# EAGLE board 7seg_interface_unit (EAGLE 9.5.2)
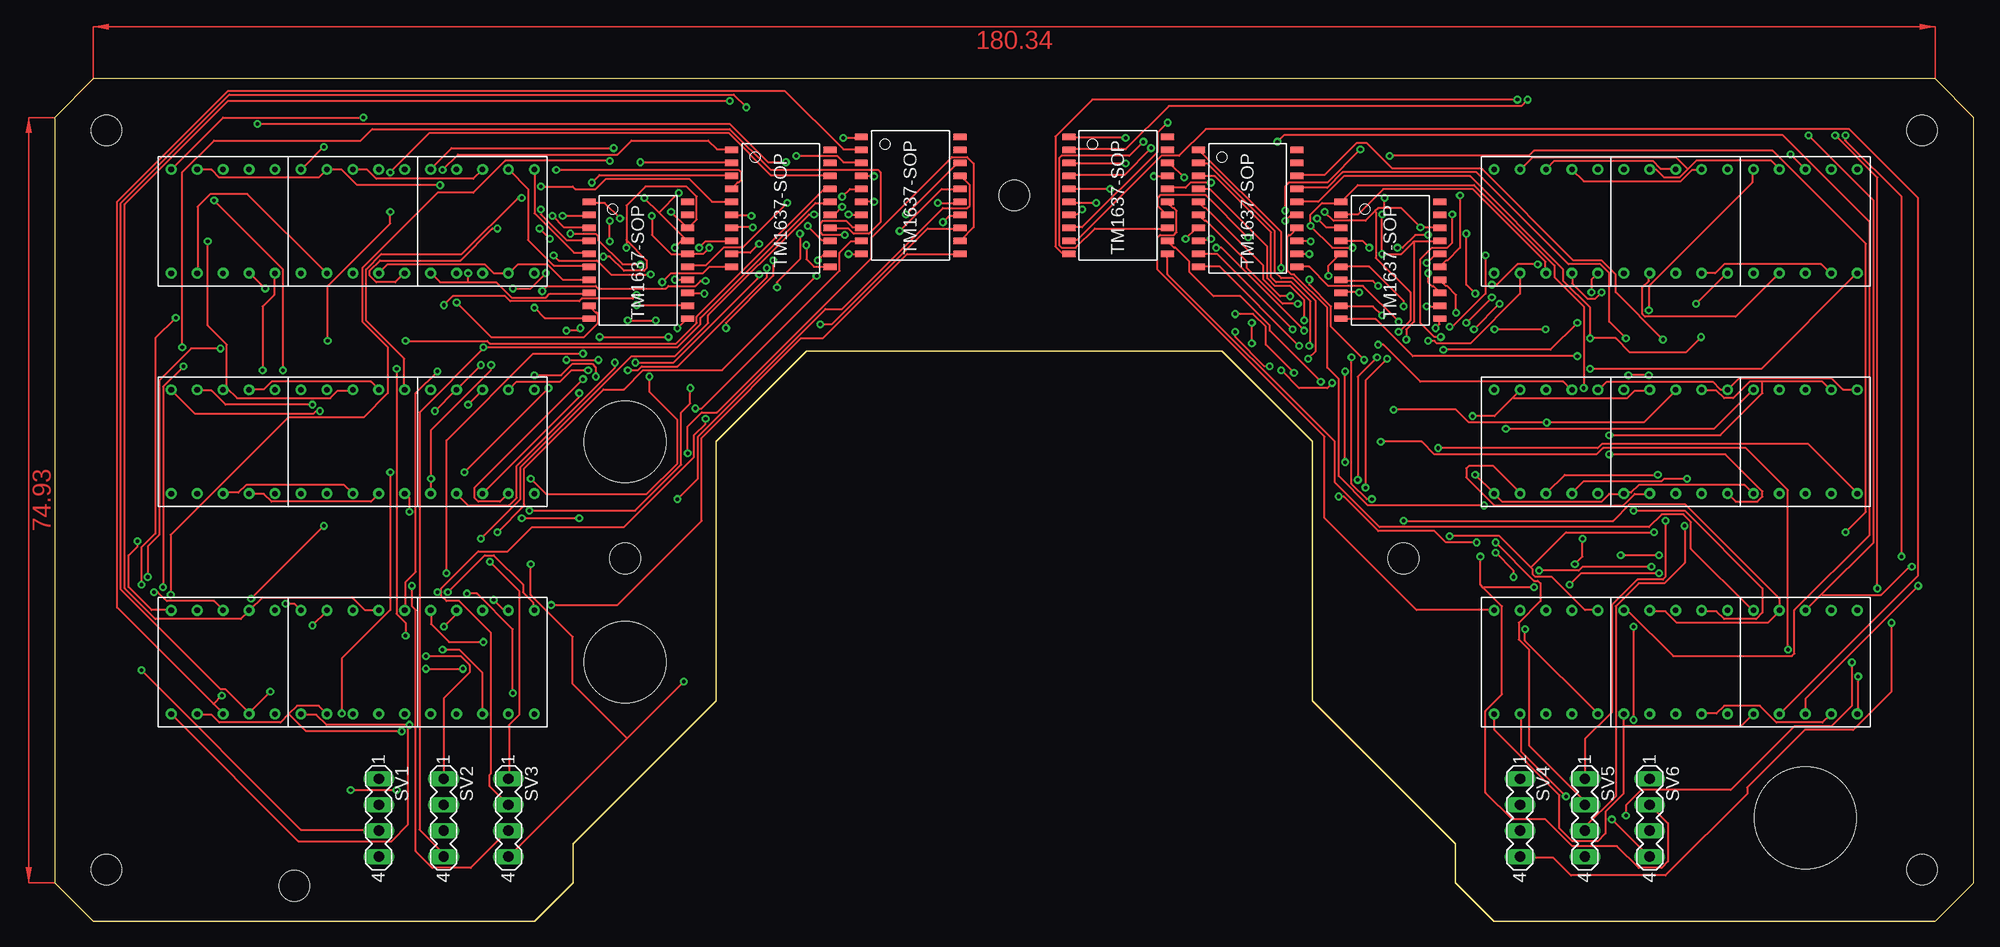
[diagram p1: board, top side]
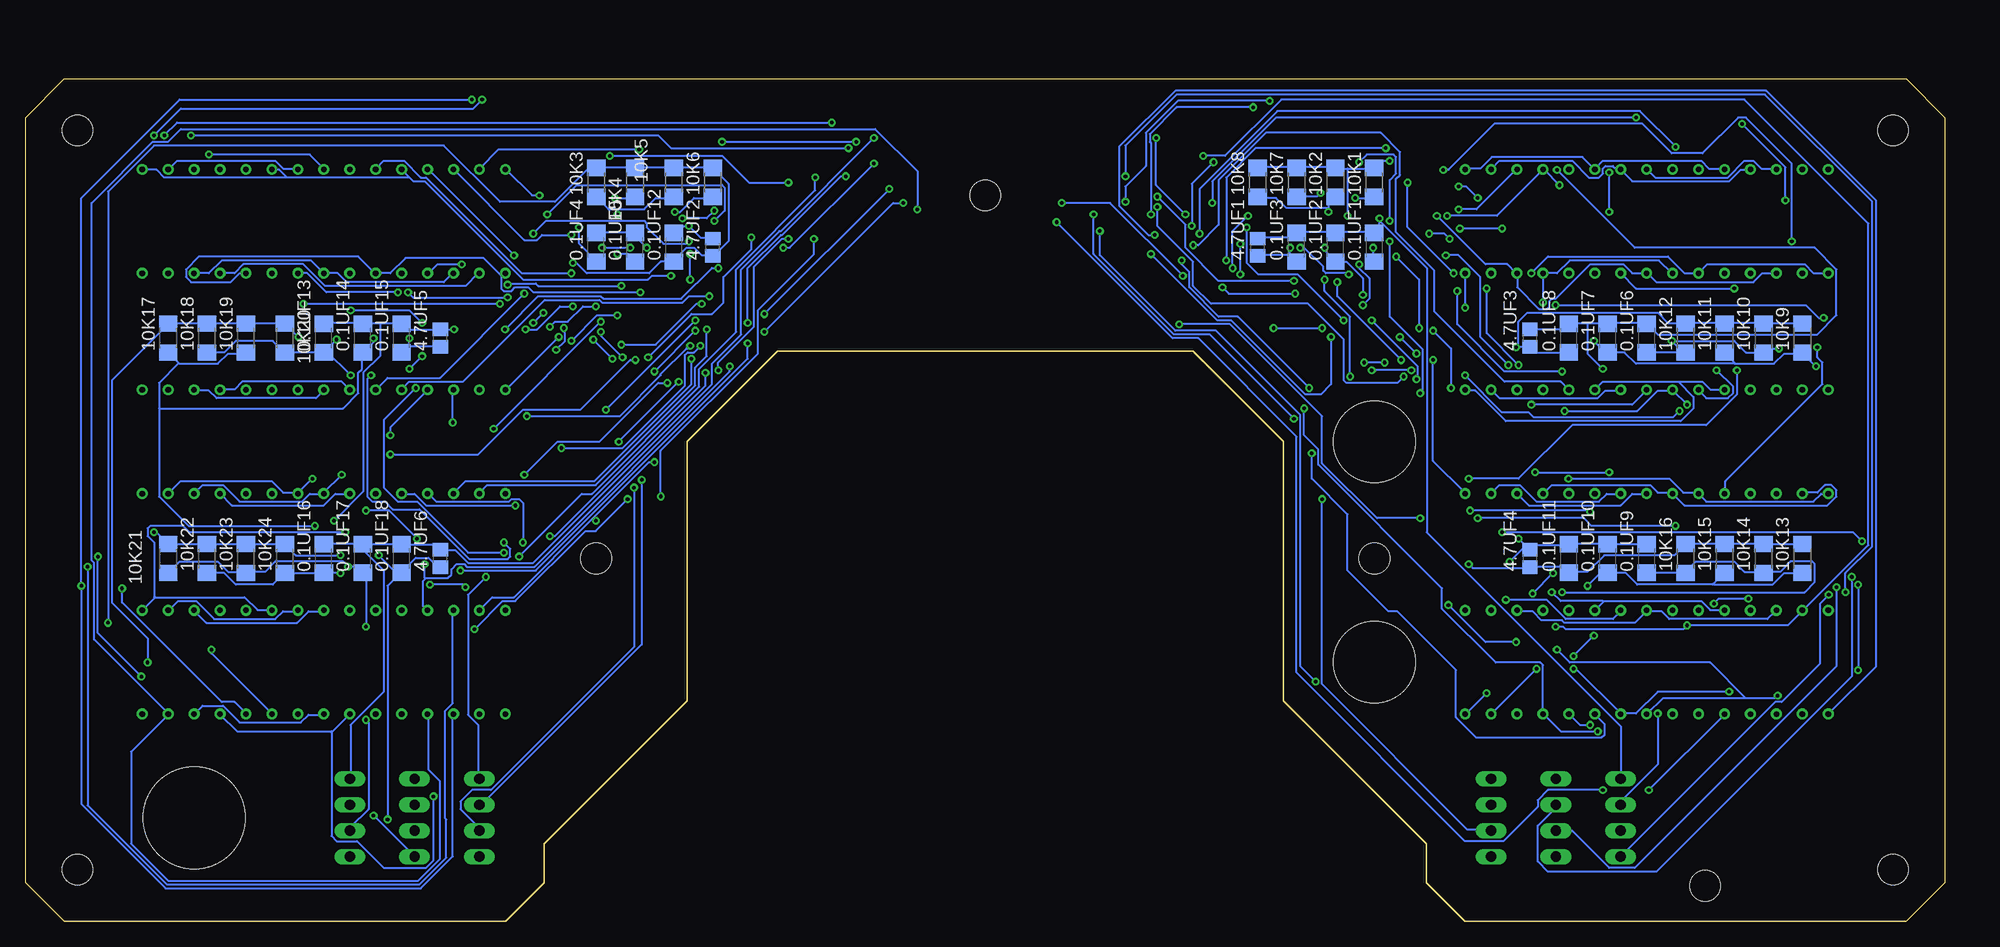
[diagram p2: board, bottom side, seen from below]

Size 187.96 x 82.55 mm. Coordinates in mm from the lower left corner, seen from the top.
Outline: 184.15,0 187.96,3.81 187.96,78.74 184.15,82.55 3.81,82.55 0,78.74 0,3.81 3.81,0 46.99,0 50.8,3.81 50.8,7.62 64.77,21.59 64.77,46.99 73.66,55.88 114.3,55.88 123.19,46.99 123.19,21.59 137.16,7.62 137.16,3.81 140.97,0 184.15,0
Copper layers (1*16): Top 0.035mm / dielectric 1.5mm / Bottom 0.035mm
Design rules "default": minimum track width 6mil, minimum drill 0.35mm, track to track 6mil, track to pad 6mil, pad to pad 6mil, via to via 6mil, smd to smd 6mil, copper to edge 40mil, drill to drill 6mil, minimum pad ring 10mil, minimum via ring 8mil, stop-mask expansion 4mil, vias tented up to drill 0mil, thermal gap 10mil
Net classes: 0 default: width 0.178 mm, clearance 0.127 mm
Holes 8 mm at 55.88,25.4 55.88,46.99
Holes 10 mm at 171.45,10.16
Holes 3 mm at 5.08,77.47 5.08,5.08 182.88,77.47 182.88,5.08 93.98,71.12 55.88,35.56 132.08,35.56 23.5,3.5

## Footprints (pad centres in the part's own frame; a part is rotated, then mirrored left to right if it is on the bottom)
C1206 = smd 1.6 x 1.8: 1 -1.4,0; 2 1.4,0
C2012 = smd 1.3 x 1.5: 1 -0.85,0; 2 0.85,0
R1206 = smd 1.6 x 1.803: 1 -1.422,0; 2 1.422,0
7SEG = drill 0.55: 1 1.27,1.27; 2 3.81,1.27; 3 6.35,1.27; 4 8.89,1.27; 5 11.43,1.27; 6 11.43,11.43; 7 8.89,11.43; 8 6.35,11.43; 9 3.81,11.43; 10 1.27,11.43
MA04-1 = drill 1.016 long: 1 -3.81,0; 2 -1.27,0; 3 1.27,0; 4 3.81,0
TM1637 = smd 1.27 x 0.635: PIN1 -4.82,5.715; PIN2 -4.82,4.445; PIN3 -4.82,3.175; PIN4 -4.82,1.905; PIN5 -4.82,0.635; PIN6 -4.82,-0.635; PIN7 -4.82,-1.905; PIN8 -4.82,-3.175; PIN9 -4.82,-4.445; PIN10 -4.82,-5.715; PIN11 4.83,-5.715; PIN12 4.83,-4.445; PIN13 4.83,-3.175; PIN14 4.83,-1.905; PIN15 4.83,-0.635; PIN16 4.83,0.635; PIN17 4.83,1.905; PIN18 4.83,3.175; PIN19 4.83,4.445; PIN20 4.83,5.715

## Placement (x,y rotation side)
0.1UF1  [C1206]  55.88,66.04 90 bottom
0.1UF2  [C1206]  59.69,66.04 90 bottom
0.1UF3  [C1206]  63.5,66.04 90 bottom
0.1UF4  [C1206]  132.08,66.04 90 bottom
0.1UF5  [C1206]  128.27,66.04 90 bottom
0.1UF6  [C1206]  29.21,57.15 90 bottom
0.1UF7  [C1206]  33.02,57.15 90 bottom
0.1UF8  [C1206]  36.83,57.15 90 bottom
0.1UF9  [C1206]  29.21,35.56 90 bottom
0.1UF10  [C1206]  33.02,35.56 90 bottom
0.1UF11  [C1206]  36.83,35.56 90 bottom
0.1UF12  [C1206]  124.46,66.04 90 bottom
0.1UF13  [C1206]  158.75,57.15 90 bottom
0.1UF14  [C1206]  154.94,57.15 90 bottom
0.1UF15  [C1206]  151.13,57.15 90 bottom
0.1UF16  [C1206]  158.75,35.56 90 bottom
0.1UF17  [C1206]  154.94,35.56 90 bottom
0.1UF18  [C1206]  151.13,35.56 90 bottom
4.7UF1  [C2012]  67.31,66.04 90 bottom
4.7UF2  [C2012]  120.65,66.04 90 bottom
4.7UF3  [C2012]  40.64,57.15 90 bottom
4.7UF4  [C2012]  40.64,35.56 90 bottom
4.7UF5  [C2012]  147.32,57.15 90 bottom
4.7UF6  [C2012]  147.32,35.56 90 bottom
10K1  [R1206]  55.88,72.39 90 bottom
10K2  [R1206]  59.69,72.39 90 bottom
10K3  [R1206]  132.08,72.39 90 bottom
10K4  [R1206]  128.27,72.39 90 bottom
10K5  [R1206]  124.46,72.39 90 bottom
10K6  [R1206]  120.65,72.39 90 bottom
10K7  [R1206]  63.5,72.39 90 bottom
10K8  [R1206]  67.31,72.39 90 bottom
10K9  [R1206]  13.97,57.15 90 bottom
10K10  [R1206]  17.78,57.15 90 bottom
10K11  [R1206]  21.59,57.15 90 bottom
10K12  [R1206]  25.4,57.15 90 bottom
10K13  [R1206]  13.97,35.56 90 bottom
10K14  [R1206]  17.78,35.56 90 bottom
10K15  [R1206]  21.59,35.56 90 bottom
10K16  [R1206]  25.4,35.56 90 bottom
10K17  [R1206]  173.99,57.15 90 bottom
10K18  [R1206]  170.18,57.15 90 bottom
10K19  [R1206]  166.37,57.15 90 bottom
10K20  [R1206]  162.56,57.15 90 bottom
10K21  [R1206]  173.99,35.56 90 bottom
10K22  [R1206]  170.18,35.56 90 bottom
10K23  [R1206]  166.37,35.56 90 bottom
10K24  [R1206]  162.56,35.56 90 bottom
LED1  7SEG  [7SEG]  10.16,62.23 0 top
LED2  7SEG  [7SEG]  22.86,62.23 0 top
LED3  7SEG  [7SEG]  35.56,62.23 0 top
LED4  7SEG  [7SEG]  22.86,40.64 0 top
LED5  7SEG  [7SEG]  35.56,40.64 0 top
LED6  7SEG  [7SEG]  10.16,40.64 0 top
LED7  7SEG  [7SEG]  22.86,19.05 0 top
LED8  7SEG  [7SEG]  35.56,19.05 0 top
LED9  7SEG  [7SEG]  10.16,19.05 0 top
LED10  7SEG  [7SEG]  152.4,62.23 0 top
LED11  7SEG  [7SEG]  165.1,62.23 0 top
LED12  7SEG  [7SEG]  139.7,62.23 0 top
LED13  7SEG  [7SEG]  152.4,40.64 0 top
LED14  7SEG  [7SEG]  165.1,40.64 0 top
LED15  7SEG  [7SEG]  139.7,40.64 0 top
LED16  7SEG  [7SEG]  152.4,19.05 0 top
LED17  7SEG  [7SEG]  165.1,19.05 0 top
LED18  7SEG  [7SEG]  139.7,19.05 0 top
SV1  [MA04-1]  31.75,10.16 270 top
SV2  [MA04-1]  38.1,10.16 270 top
SV3  [MA04-1]  44.45,10.16 270 top
SV4  [MA04-1]  143.51,10.16 270 top
SV5  [MA04-1]  149.86,10.16 270 top
SV6  [MA04-1]  156.21,10.16 270 top
TM1637-SMD1  TM1637  [TM1637]  57.15,64.77 0 top
TM1637-SMD2  TM1637  [TM1637]  71.12,69.85 0 top
TM1637-SMD3  TM1637  [TM1637]  83.82,71.12 0 top
TM1637-SMD4  TM1637  [TM1637]  130.81,64.77 0 top
TM1637-SMD5  TM1637  [TM1637]  116.84,69.85 0 top
TM1637-SMD6  TM1637  [TM1637]  104.14,71.12 0 top

## Tracks (layer width: path | path; a pad name or v marks a point on that pad's centre or on a via)
N$1  (via drill 0.35)
  Top 0.178: 40.5,62.62 37.75,62.62 36.88,63.5 LED3.1 | 40.5,62.62 43.25,62.62 44.75,61.12 48.12,61.12 48.5,61.5 52.25,61.5 TM1637-SMD1.PIN8 | 40.5,62.62 v40.5,63.5
  Bottom 0.178: LED1.1 12.88,63.5 13.75,64.38 23.25,64.38 LED2.1 25.5,63.5 27.12,65.12 38.88,65.12 v40.5,63.5
N$2  (via drill 0.35)
  Top 0.178: v39.38,60.62 42.75,57.25 51.88,57.25 53.25,58.62 53.25,59.5 53.12,59.62 53,59.62 52.38,60.25 TM1637-SMD1.PIN9 | LED1.2 14,63.5 14,70 15.25,71.25 18.88,71.25 26.62,63.5 LED2.2
  Bottom 0.178: v39.38,60.62 LED3.2 38,63.5 36.75,64.75 28,64.75 26.75,63.5 LED2.2
N$3  (via drill 0.35)
  Top 0.178: v49.75,69.12 52.25,69.12 TM1637-SMD1.PIN2
  Bottom 0.178: LED1.3 17.88,63.5 18.75,62.62 28.25,62.62 29.12,63.5 LED2.3 30.62,63.5 31.5,64.38 34.75,64.38 38.12,61 38.5,61 38.75,60.75 38.75,60.25 39,60 39.75,60 41.88,62.12 41.88,63.5 LED3.3 42,63.5 42.88,64.38 45,64.38 v49.75,69.12
N$4  (via drill 0.35)
  Top 0.178: v127.75,61.62 126,61.62 TM1637-SMD4.PIN8
  Bottom 0.178: v127.75,61.62 138.25,61.62 138.75,62.12 140,62.12 140.38,61.75 141.12,61.75 141.38,62 141.38,63.12 141,63.5 LED12.1 141.38,63.25 143.12,65 150.75,65 152.25,63.5 LED10.1 153.75,63.5 155.38,65.12 171,65.12 172.25,63.88 172.25,63.12 171.75,62.62 167.88,62.62 167,63.5 LED11.1
N$5  (via drill 0.35)
  Top 0.178: LED10.2 156.12,63.5 156.12,62.75 155.5,62.12 155.5,59.5 155.75,59.25 164.62,59.25 168.88,63.5 LED11.2 | v130,59.38 129.12,60.25 126,60.25 TM1637-SMD4.PIN9 | v134.5,56.88 135.12,56.88 135.38,56.62 138.62,56.62 143.5,61.5 LED12.2
  Bottom 0.178: v130,59.38 132,59.38 v134.5,56.88 | LED11.2 167.5,63.5 166.62,64.38 160.75,64.38 158.62,62.25 144.88,62.25 143.62,63.5 LED12.2
N$6  (via drill 0.35)
  Top 0.178: TM1637-SMD1.PIN7 52.25,62.88 49.75,62.88 48.25,64.38 45.38,64.38 44.5,63.5 LED3.4 43,63.5 42.12,64.38 32.62,64.38 LED2.4 | v20.62,62 19.12,63.5 LED1.4
  Bottom 0.178: v20.62,62 30.25,62 LED2.4
N$7
  Top 0.178: TM1637-SMD4.PIN2 126,69.25 127.62,69.25 130.12,71.75 138.88,71.75 146,64.62 146,63.5 LED12.3
  Bottom 0.178: LED12.3 146.12,63.5 147,62.62 156.5,62.62 157.38,63.5 LED10.3 160,64.75 168.75,64.75 170,63.5 LED11.3
N$8
  Top 0.178: TM1637-SMD1.PIN5 52.25,65.5 50.88,65.5 47,69.38 47,73.62 LED3.6
  Bottom 0.178: LED1.6 21.62,73.75 23.12,73.75 23.88,74.5 33.5,74.5 34.25,73.75 LED2.6 34.38,73.75 35.5,74.88 44.38,74.88 45.5,73.75 46.88,73.75 LED3.6
N$9
  Top 0.178: TM1637-SMD1.PIN6 52.25,64.25 48.88,64.25 46.38,66.75 46.38,71.75 44.5,73.62 LED3.7
  Bottom 0.178: LED1.7 19.12,73.62 20,73.62 21.12,72.5 30.62,72.5 31.75,73.62 LED2.7 31.75,73.75 32.25,73.75 32.5,74 33.25,74 33.5,73.75 33.5,73.25 33.88,72.88 34.88,72.88 36.5,74.5 43.62,74.5 44.38,73.75 LED3.7
N$10  (via drill 0.35)
  Top 0.178: LED10.4 162.62,63.5 163.5,64.38 173,64.38 173.88,63.5 LED11.4 | v129.62,62.25 129.12,62.75 126,62.75 TM1637-SMD4.PIN7 | v140.75,62.38 141.25,62.38 143.25,64.38 v145.25,64.38 | v151.5,61.62 150.88,61 150.12,61 148.62,62.5 148.62,63.5 LED12.4
  Bottom 0.178: v129.62,62.25 137.75,62.25 138,62.5 140.62,62.5 v140.75,62.38 | v145.25,64.38 147.62,64.38 148.5,63.5 LED12.4 | LED10.4 160.38,63.5 158.5,61.62 v151.5,61.62
N$11  (via drill 0.35)
  Top 0.178: v47.62,69.75 47.62,69.25 50.12,66.75 52.25,66.75 TM1637-SMD1.PIN4 | LED3.8 41,72.75 31.5,72.75 30.62,73.62 29.25,73.62 LED2.8
  Bottom 0.178: LED1.8 16.62,73.75 18,73.75 18.75,74.5 19.62,74.5 21.25,72.88 28.38,72.88 29.12,73.62 LED2.8 | v47.62,69.75 45.88,69.75 42,73.62 LED3.8
N$12  (via drill 0.35)
  Top 0.178: LED1.9 14,73.62 15.38,73.62 16.12,72.88 25.88,72.88 26.62,73.62 LED2.9 26.75,73.62 28.12,73.62 29.62,72.12 v37.75,72.12 | v48.75,69.12 49.88,68 52.25,68 TM1637-SMD1.PIN3
  Bottom 0.178: v48.75,69.12 43.88,69.12 39.38,73.62 LED3.9 39.25,73.62 v37.75,72.12
N$13  (via drill 0.35)
  Top 0.178: v47,60.12 48,59.12 52.25,59.12 TM1637-SMD1.PIN10
  Bottom 0.178: v47,60.12 LED3.5
N$14  (via drill 0.35)
  Top 0.178: v61,58.12 61.88,59 TM1637-SMD1.PIN11 | v65.75,58.12 65.75,58.62 70.38,63.25 v70.38,64.75 | v54.75,75.75 38.88,75.75 36.88,73.75 LED3.10
  Bottom 0.178: v65.75,58.12 v61,58.12 | v70.38,64.75 70.38,72.88 67.5,75.75 v54.75,75.75
N$15  (via drill 0.35)
  Top 0.178: v57,60.38 61.88,60.38 TM1637-SMD1.PIN12 | v57.38,64.38 55.62,64.38 53.25,66.75 53.25,67.12 53,67.38 v50.5,67.38 | v47.5,67.88 v48.5,66.88 | v43.38,67.88 42.88,67.88 39.75,64.75 31.88,64.75 30.88,63.75 30.88,63.25 31.5,62.62 33.38,62.62 34.25,63.5 LED2.5
  Bottom 0.178: v57,60.38 56.38,61 56.38,63 57.38,64 v57.38,64.38 | v50.5,67.38 49,67.38 v48.5,66.88 | v43.38,67.88 v47.5,67.88
N$16  (via drill 0.35)
  Top 0.178: v63.62,61.5 62,61.5 TM1637-SMD1.PIN13 | v70.75,62.12 70.75,62.62 73,64.88 v73,67.38 | v26.38,75.88 24.25,73.75 LED2.10
  Bottom 0.178: v63.62,61.5 70.12,61.5 v70.75,62.12 | v73,67.38 73,71.75 65.38,79.38 29.88,79.38 v26.38,75.88
N$17  (via drill 0.35)
  Top 0.178: v60.75,62.88 61.88,62.88 TM1637-SMD1.PIN14 | v58.25,53.38 58.25,51.88 61,49.12 61,44.88 58,41.88 48.12,41.88 v46.62,43.38 | v20.38,54 20.38,60.25 21.5,61.38 21.5,63.5 LED1.5
  Bottom 0.178: v60.75,62.88 60.75,61.75 58.25,59.25 v58.25,53.38 | v46.62,43.38 41.75,43.38 36.5,48.62 23.38,48.62 20.38,51.62 v20.38,54
N$18  (via drill 0.35)
  Top 0.178: v71.75,70.38 67.38,66 65.5,66 63.75,64.25 62,64.25 TM1637-SMD1.PIN15 | v30.25,78.75 16.5,78.75 11.5,73.75 LED1.10
  Bottom 0.178: v71.75,70.38 71.75,72.5 65.5,78.75 v30.25,78.75
N$19  (via drill 0.35)
  Top 0.178: v60.38,69.5 61.88,68 TM1637-SMD1.PIN18 62,67.88 62.88,68.75 62.88,71 61.88,72 57.88,72 56,70.12 56,66.75 | 56,66.75 v56,66 | v28.12,20.38 28.12,25.75 32.88,30.5 v32.88,44 | v48.38,52.25 v40.12,44 | v50.12,57.88 51.25,57.88 v51.5,58.12 | v53.75,65.12 54.38,65.12 55.75,63.75 57.75,63.75 58,64 58,64.75 56,66.75
  Bottom 0.178: 60.38,69.88 60.38,70.25 59.75,70.88 10K2.1 | v56,66 56,64.75 0.1UF1.1 | 60.38,69.88 64.5,69.88 65.5,70.88 67.25,70.88 10K8.1 | 60.38,69.88 v60.38,69.5 | SV1.2 31.75,11.75 28.12,15.38 v28.12,20.38 | v40.12,44 v32.88,44 | v48.38,52.25 48.38,56.12 v50.12,57.88 | v51.5,58.12 51.5,62.88 v53.75,65.12
N$20  (via drill 0.35)
  Top 0.178: v60.75,66 61.38,66.62 61.88,66.62 TM1637-SMD1.PIN17 61.88,66.75 59.19,69.44 | 59.19,69.44 v57.75,70.88 | 59.19,69.44 v61.12,71.38 | v8.5,24.62 24.12,9 31.75,9 SV1.3 | v8.5,33 8.5,36.62 9.88,38 9.88,57.12 v11.88,59.12 | v38.12,60.38 39,61.25 44.12,61.25 44.62,60.75 51.38,60.75 51.62,61 56.62,61 v57,61.38
  Bottom 0.178: v60.75,66 60.75,65.75 59.75,64.75 0.1UF2.1 59.62,64.62 58.62,64.62 57,63 v57,61.38 | v57.75,70.88 56,70.88 10K1.1 | v61.12,71.38 61.5,71 63.5,71 10K7.1 | v8.5,33 v8.5,24.62 | v11.88,59.12 12.38,59.12 13.62,60.38 v38.12,60.38
N$21  (via drill 0.35)
  Top 0.178: v64.12,66 63.5,65.38 62,65.38 TM1637-SMD1.PIN16 61.88,65.38 60.38,65.38 58.5,67.25 v58.5,69.12 | v11.38,32 11.38,37.88 22.88,49.38 30.25,49.38 32.62,51.75 32.62,56.25 30.12,58.75 30.12,64 37.5,71.38 41,71.38 44.12,74.5 v54.38,74.5
  Bottom 0.178: v64.12,66 64.12,65.38 63.5,64.75 0.1UF3.1 64.12,65.25 67.25,65.25 4.7UF1.1 | 58.5,73.75 59.62,73.75 10K2.2 59.75,73.88 63.5,73.88 | 58.5,73.75 56,73.75 10K1.2 55.88,73.88 55.25,74.5 v54.38,74.5 | 63.5,73.88 67.25,73.88 10K8.2 | 63.5,73.88 10K7.2 | v11.38,32 12.25,31.12 12.25,25.25 16,21.5 16.62,21.5 31.75,6.38 SV1.4 | 58.5,73.75 v58.5,69.12
N$22  (via drill 0.35)
  Top 0.178: v55.38,68.88 53.88,70.38 52.38,70.38 TM1637-SMD1.PIN1
  Bottom 0.178: 4.7UF1.2 67.25,67 63.88,67 63.5,67.38 0.1UF3.2 63.5,67.5 59.75,67.5 0.1UF2.2 59.62,67.5 56,67.5 0.1UF1.2 55.88,67.5 55.38,68 55.38,68.62 | SV1.1 31.75,19.12 50.75,38.12 50.75,64 55.38,68.62 | 55.38,68.62 v55.38,68.88
N$23  (via drill 0.35)
  Top 0.178: v63.12,66 63.75,66.62 66.25,66.62 TM1637-SMD2.PIN8 | v58.38,63.38 54.5,63.38 53.12,64.75 49.38,64.75 v48.88,65.25 | v42.75,54.5 42.75,54 36.88,48.12 v36.88,43.38 36.88,42 LED5.1
  Bottom 0.178: LED6.1 11.5,41.88 12.12,41.88 12.88,41.12 23.38,41.12 24.12,41.88 LED4.1 24.25,42 25.62,42 27,43.38 v36.88,43.38 | v63.12,66 62.75,66 60.88,64.12 60.88,63.75 60.62,63.5 58.5,63.5 v58.38,63.38 | v48.88,65.25 47.62,65.25 45.5,63.12 45.5,57.25 v42.75,54.5
N$24  (via drill 0.35)
  Top 0.178: v69,66.38 68.12,65.5 66.38,65.5 TM1637-SMD2.PIN9 | v69,63.38 69,63.12 60.62,54.75 v56.88,54.75 | v54.88,54.75 54.88,54.25 45.25,44.62 45.25,41.5 44.5,40.75 40.5,40.75 39.38,41.88 LED5.2
  Bottom 0.178: LED6.2 13.88,42 12.5,42 11.75,42.75 11.12,42.75 10.62,42.25 10.62,41.62 11.5,40.75 25.5,40.75 26.62,41.88 LED4.2 26.75,42 28.12,42 28.88,42.75 38.5,42.75 39.25,42 LED5.2 | v69,63.38 v69,66.38 | v54.88,54.75 v56.88,54.75
N$25  (via drill 0.35)
  Top 0.178: LED6.3 16.62,42 18,42 18.75,42.75 28.38,42.75 29.12,42 LED4.3 | v57.38,74.38 66.25,74.38 TM1637-SMD2.PIN2 | v54.38,66.62 v54.38,68.62 | v51.38,51.75 51.38,51.38 LED5.3
  Bottom 0.178: v57.38,74.38 56.62,75.12 54,75.12 53.75,74.88 53.75,73.25 54.38,72.62 v54.38,68.62 | v54.38,66.62 54.38,59.25 51.12,56 51.12,52 v51.38,51.75 | LED5.3 40.75,40.75 31.75,40.75 30.62,41.88 29.25,41.88 LED4.3
N$26  (via drill 0.35)
  Top 0.178: LED6.4 19.12,41.88 20.5,41.88 21.25,41.12 31,41.12 31.75,41.88 LED4.4 | v68.38,68 66.38,68 TM1637-SMD2.PIN7 | v56.12,58.88 v58.88,58.88 | v51.75,53.12 41.12,42.5 41.12,41.5 41.5,41.12 43.62,41.12 44.38,41.88 LED5.4
  Bottom 0.178: v68.38,68 68.38,64.5 67.25,63.38 63.38,63.38 v58.88,58.88 | v56.12,58.88 51.62,54.38 51.62,53.25 v51.75,53.12 | LED4.4 31.75,41.88 33.12,41.88 33.88,41.12 40,41.12 41.62,42.75 43.62,42.75 44.38,42 LED5.4
N$27  (via drill 0.35)
  Top 0.178: v47.62,72 50.75,72 51,71.75 53,71.75 54,72.75 62.12,72.75 64.38,70.5 66.25,70.5 TM1637-SMD2.PIN5 | v45.75,70.88 45.38,70.88 39.88,65.38 32,65.38 30.5,63.88 30.5,58.88 34.25,55.12 34.25,52.12 LED4.6
  Bottom 0.178: v47.62,72 46.88,72 v45.75,70.88 | 26.12,52.88 33.5,52.88 34.25,52.12 LED4.6 | 26.12,52.88 23.75,52.88 23,52.12 21.62,52.12 LED6.6 | 26.12,52.88 24.62,51.38 24.62,50.25 25.88,49 43,49 46,52 46.88,52 LED5.6
N$28  (via drill 0.35)
  Top 0.178: LED6.7 19.12,52.12 20.5,52.12 21.25,52.88 31,52.88 31.75,52.12 LED4.7 | v68.25,69.12 66.38,69.12 TM1637-SMD2.PIN6 | v69.75,64 69.75,63.12 61,54.38 57.5,54.38 57.12,54 v56.12,54 | v52.25,54 50.62,54 49.5,52.88 45.25,52.88 44.5,52.12 LED5.7
  Bottom 0.178: v68.25,69.12 69.75,67.62 v69.75,64 | v52.25,54 v56.12,54 | LED4.7 31.75,52 33.25,52 34,51.25 43.62,51.25 44.38,52 LED5.7
N$29  (via drill 0.35)
  Top 0.178: v49.12,73.62 67,73.62 67.25,73.38 67.25,72.62 67,72.38 66.88,72.38 66.38,71.88 TM1637-SMD2.PIN4 | v15,66.62 15,58.38 16.88,56.5 16.88,52.38 16.62,52.12 LED6.8 16.88,52.25 17.88,51.25 27,51.25 27.75,52 29.12,52 LED4.8 | v40.5,50.62 41.88,52 LED5.8
  Bottom 0.178: v49.12,73.62 48.62,73.62 44.12,78.12 29.62,78.12 26.75,75.25 23.75,75.25 20.25,78.75 19.5,78.75 15,74.25 v15,66.62 | v40.5,50.62 30.62,50.62 29.25,52 LED4.8
N$30  (via drill 0.35)
  Top 0.178: v25.25,50.62 16.75,50.62 15.38,52 14,52 LED6.9 | v52.62,72.38 53.38,73.12 66.25,73.12 TM1637-SMD2.PIN3 | v48.12,63.5 46.62,62 v44.88,62 | v41.75,54.5 39.38,52.12 LED5.9 39.25,52 v37.25,50
  Bottom 0.178: v25.25,50.62 26.62,52 LED4.9 26.75,52 28.12,52 30.12,50 v37.25,50 | v52.62,72.38 52.62,68 v48.12,63.5 | v44.88,62 44.88,57.62 v41.75,54.5
N$31  (via drill 0.35)
  Top 0.178: v59.5,62.62 60.38,63.5 63.5,63.5 64.12,64.12 66.25,64.12 TM1637-SMD2.PIN10 | v50.12,55 v53.25,55
  Bottom 0.178: v59.5,62.62 59.5,61.25 v53.25,55 | v50.12,55 50.12,45.12 47,42 LED5.5
N$32  (via drill 0.35)
  Top 0.178: v73.62,66.25 73.62,64.88 74.38,64.12 75.88,64.12 TM1637-SMD2.PIN11
  Bottom 0.178: v73.62,66.25 73.12,66.25 71.12,68.25 71.12,72.62 66.5,77.25 55.25,77.25 53.38,75.38 53.38,73.12 53.75,72.75 53.75,67.5 50,63.75 50,59.75 43.12,52.88 37.62,52.88 36.88,52.12 LED5.10
N$33  (via drill 0.35)
  Top 0.178: v74.75,64.75 75.38,65.38 75.88,65.38 TM1637-SMD2.PIN12 | v62.25,52.25 62.25,50.75 61.38,49.88 61.38,44.75 56.88,40.25 v46.5,40.25 | v34.75,40.12 34.75,41.5 34.38,41.88 LED4.5
  Bottom 0.178: v74.75,64.75 74.75,64.38 74,63.62 74,62.12 71.12,59.25 69.25,59.25 v62.25,52.25 | v46.5,40.25 34.88,40.25 v34.75,40.12
N$34  (via drill 0.35)
  Top 0.178: v124.75,63.25 124.75,64.25 125.88,65.38 TM1637-SMD4.PIN5
  Bottom 0.178: v124.75,63.25 126.62,63.25 127,62.88 139.25,62.88 148.88,72.5 150,72.5 150.44,72.94 | 150.44,72.94 151.12,73.62 LED12.6 | 162.44,72.94 162.38,72.88 150.5,72.88 150.44,72.94 | 162.44,72.94 163.12,73.62 163.75,73.62 LED10.6 | LED11.6 176.5,73.62 175.12,73.62 174.38,72.88 162.5,72.88 162.44,72.94
N$35  (via drill 0.35)
  Top 0.178: v73.75,68.12 75.12,66.75 75.88,66.75 TM1637-SMD2.PIN13 | v71.62,74.38 69.88,74.38 66.12,78.12 v19.88,78.12 | v15.62,70.62 22.38,63.88 v22.38,54
  Bottom 0.178: v73.75,68.12 73.75,72.25 v71.62,74.38 | v19.88,78.12 15.62,73.88 v15.62,70.62 | v22.38,54 20.75,52.38 20.75,51.75 21.25,51.25 23.38,51.25 24.12,52 LED4.10
N$36  (via drill 0.35)
  Top 0.178: v12.5,56.25 12.5,73.38 15.62,76.5 30,76.5 31.12,77.62 66.12,77.62 70.12,73.62 80.62,73.62 80.88,73.38 80.88,68.5 79.75,67.38 78.25,67.38 77.75,67.88 76,67.88 TM1637-SMD2.PIN14
  Bottom 0.178: v12.5,56.25 12.5,55.25 12,54.75 12,52.62 21.5,43.12 21.5,42 LED6.5
N$37  (via drill 0.35)
  Top 0.178: v77.12,70 76.38,69.25 76,69.25 TM1637-SMD2.PIN15 | v53,53.38 53,54.25 52.62,54.62 50.75,54.62 49.62,53.5 v47,53.5 | v26,50 25.62,50 25.38,49.75 13.75,49.75 LED6.10
  Bottom 0.178: v77.12,70 77.12,68.12 73.62,64.62 73.62,62.25 71.88,60.5 62.38,60.5 58.88,57 58.88,53 58.62,52.75 53.62,52.75 v53,53.38 | v47,53.5 43.38,49.88 40.75,49.88 40.25,49.38 26.62,49.38 v26,50
N$38  (via drill 0.35)
  Top 0.178: v32.88,73.38 36.75,77.25 66,77.25 70.12,73.12 75.88,73.12 TM1637-SMD2.PIN18 | v32.88,69.5 32.88,68.38 26.75,62.25 v26.75,56.88 | v9.12,33.75 9.12,36.75 10.25,37.88 10.25,53 13.38,56.12 v16.25,56.12
  Bottom 0.178: v32.88,69.5 v32.88,73.38 | 0.1UF6.1 25.75,55.75 10K12.1 25.5,55.62 v26.75,56.88 20.62,56.88 19.5,55.75 17.88,55.75 10K10.1 17.75,55.75 17.38,56.12 v16.25,56.12 | v9.12,33.75 9.12,24 28.25,4.88 38.88,4.88 39.88,5.88 39.88,9.38 38.12,11.12 38.12,11.38 SV2.2
N$39  (via drill 0.35)
  Top 0.178: v34.38,56.88 42.38,56.88 42.62,56.62 60.88,56.62 62.88,58.62 62.88,59.25 75.38,71.75 75.88,71.75 TM1637-SMD2.PIN17 | v10.62,32.75 10.62,52.38 v12.62,54.38
  Bottom 0.178: v34.38,56.88 33.25,55.75 0.1UF7.1 31.38,55.75 30.25,54.62 20.62,54.62 20.56,54.69 | 20.56,54.69 21.5,55.62 10K11.1 | 20.56,54.69 20.5,54.62 16.75,54.62 15.75,55.62 14,55.62 10K9.1 13.88,55.62 v12.62,54.38 | v10.62,32.75 10.62,25 30.38,5.25 32.88,5.25 36.5,8.88 38,8.88 SV2.3
N$40  (via drill 0.35)
  Top 0.178: 42.12,56.25 61,56.25 63.25,58.5 63.25,59.12 74.5,70.38 75.88,70.38 TM1637-SMD2.PIN16 | 42.12,56.25 35.75,49.88 35.75,9 38,6.75 38,6.38 SV2.4 | 42.12,56.25 v42,56.25
  Bottom 0.178: 10K9.2 14,58.62 17.75,58.62 10K10.2 17.88,58.62 21.5,58.62 10K11.2 21.62,58.62 25.38,58.62 10K12.2 25.5,58.62 27.12,58.62 28.12,59.62 40.88,59.62 41.75,58.75 41.75,56.25 | 41.75,56.25 40.75,56.25 4.7UF3.1 40.62,56.25 40.12,55.75 0.1UF8.1 | 41.75,56.25 v42,56.25
N$41  (via drill 0.35)
  Top 0.178: v36.38,26 39.75,26 40.62,25.12 40.62,24.38 38.12,21.88 38.12,14 SV2.1 | v34.38,28 34.38,29.25 33.5,30.12 v33.5,54.12 | v38,73.62 39.5,75.12 55.12,75.12 56.5,76.5 64,76.5 64.88,75.62 66.25,75.62 TM1637-SMD2.PIN1
  Bottom 0.178: 4.7UF3.2 37.38,58 36.88,58.5 0.1UF8.2 36.75,58.62 35,58.62 | 35,58.62 33.12,58.62 0.1UF7.2 33,58.62 29.25,58.62 0.1UF6.2 29.12,58.5 28.12,57.5 12.5,57.5 10.62,59.38 10.62,63.88 12.75,66 30.38,66 v38,73.62 | v34.38,28 v36.38,26 | v33.5,54.12 35,55.62 35,58.62
N$42  (via drill 0.35)
  Top 0.178: 34.62,19.25 26.62,19.25 25.62,20.25 24.25,20.25 LED7.1 | v77.38,67.25 75.25,67.25 75,67.5 75,68.38 75.25,68.62 77.5,68.62 78.12,68 79,68 TM1637-SMD3.PIN8 | 34.62,19.25 34.62,9.5 33,7.88 23.88,7.88 LED9.1 | 34.62,19.25 v34.75,19.25
  Bottom 0.178: v34.75,19.25 35.75,19.25 36.75,20.25 LED8.1 | v77.38,67.25 78,67.25 80.88,70.12 80.88,75.88 75.38,81.38 17.5,81.38 6.75,70.62 6.75,25 LED9.1
N$43  (via drill 0.35)
  Top 0.178: 22.94,20.31 23.75,21.12 25.88,21.12 26.62,20.38 LED7.2 | 22.94,20.31 22.12,19.5 16.12,19.5 15.38,20.25 14,20.25 LED9.2 | v62.75,50.25 63.38,50.25 76.88,63.75 76.88,65.5 78,66.62 79,66.62 TM1637-SMD3.PIN9 | 22.94,20.31 24.62,18.62 v34,18.62
  Bottom 0.178: v62.75,50.25 62.75,47.62 61.38,46.25 61.38,44.75 49.25,32.62 49.25,30.62 44,25.38 39.62,25.38 39.38,25.12 39.38,20.38 LED8.2 39.25,20.25 37.62,18.62 v34,18.62
N$44  (via drill 0.35)
  Top 0.178: v132.12,60.25 132.12,60.75 128.75,64.12 TM1637-SMD4.PIN6 | v136.62,58.25 136.88,58.25 140.12,61.5 v140.12,65.25 | LED12.7 149.75,72.5 159.25,72.5 160.38,73.62 161.25,73.62 LED10.7
  Bottom 0.178: LED10.7 161.38,73.75 162.75,73.75 163.5,74.5 173.12,74.5 173.88,73.75 LED11.7 | v132.12,60.25 133.38,60.25 134.88,58.75 136.12,58.75 v136.62,58.25 | v140.12,65.25 148.5,73.62 LED12.7
N$45  (via drill 0.35)
  Top 0.178: 15.56,21.31 16.5,20.38 LED9.3 | 15.56,21.31 6.12,30.75 6.12,70.5 17,81.38 71.5,81.38 77.25,75.62 79,75.62 TM1637-SMD3.PIN2 | 15.56,21.31 v16.38,22.12 | v38,26.62 39.62,26.62 41.88,24.38 41.88,20.38 LED8.3
  Bottom 0.178: 19.5,21.88 16.62,21.88 v16.38,22.12 | 19.5,21.88 27.62,21.88 29.12,20.38 LED7.3 | v38,26.62 36.75,25.38 23,25.38 19.5,21.88
N$46  (via drill 0.35)
  Top 0.178: v77.75,69.25 79,69.25 TM1637-SMD3.PIN7 | v67.75,79.75 66.5,81 17.12,81 6.5,70.38 6.5,32.5 16.25,22.75 16.75,22.75 19.12,20.38 LED9.4 19.12,20.5 v21.12,22.5 | v36.38,24.75 v40,24.75
  Bottom 0.178: v77.75,69.25 77.75,76.25 77.88,76.38 77.88,77.12 75.25,79.75 v67.75,79.75 | 31.75,20.38 30.25,20.38 28.12,22.5 v21.12,22.5 | v40,24.75 44.38,20.38 LED8.4 | v36.38,24.75 36.12,24.75 31.75,20.38 | 31.75,20.38 LED7.4
N$47  (via drill 0.35)
  Top 0.178: v77.12,71 77.88,71.75 TM1637-SMD3.PIN5 | v63.75,62.75 63.25,62.75 62.75,62.25 60.12,62.25 59.88,62 53.25,62 53,62.25 48.25,62.25 v47.75,61.75 | v37.5,53.88 35.38,51.75 35.38,34.25 34.38,33.25 34.38,30.5 LED7.6 | v38.5,32.25 42.12,35.88 43,35.88 45.88,33 45.88,32.25 46.88,31.25 46.88,30.5 LED8.6
  Bottom 0.178: v77.12,71 74.38,68.25 74.38,66 71.12,62.75 v63.75,62.75 | v47.75,61.75 47.75,58.5 43.12,53.88 v37.5,53.88 | 33.44,31.31 34.25,30.5 LED7.6 | 33.44,31.31 33.38,31.38 23.88,31.38 23,30.5 21.62,30.5 LED9.6 | v38.5,32.25 37.62,31.38 33.5,31.38 33.44,31.31
N$48  (via drill 0.35)
  Top 0.178: v80.25,70.5 79,70.5 TM1637-SMD3.PIN6 | v66.12,80.38 17,80.38 6.88,70.25 6.88,32.62 9.88,29.62 18.25,29.62 19,30.38 LED9.7 19.12,30.5 20.38,31.75 29.12,31.75 30.38,30.5 31.75,30.5 LED7.7 | v43,31.5 44,30.5 44.38,30.5 LED8.7
  Bottom 0.178: v80.25,70.5 80.25,72 78.25,74 78.25,77.25 75.12,80.38 v66.12,80.38 | v43,31.5 39,31.5 37.12,29.62 32.5,29.62 31.75,30.38 LED7.7
N$49  (via drill 0.35)
  Top 0.178: v80.25,73 79,73 TM1637-SMD3.PIN4 | v9.75,32.25 10.12,32.25 11,31.38 15.62,31.38 16.5,30.5 LED9.8
  Bottom 0.178: v80.25,73 80.25,76 75.25,81 17.62,81 7.12,70.5 7.12,36.75 9.75,34.12 v9.75,32.25 | LED9.8 16.62,30.38 17.38,29.62 27,29.62 27.75,30.38 29.12,30.38 LED7.8 29.25,30.38 30.38,29.25 37.25,29.25 37.5,29.5 39.5,29.5 40.38,30.38 41.88,30.38 LED8.8
N$50  (via drill 0.35)
  Top 0.178: v72.62,75 76.62,75 77.25,74.38 79,74.38 TM1637-SMD3.PIN3 | v25.25,29 26.62,30.38 LED7.9 | v38.12,28.88 39.25,30 39.25,30.38 LED8.9
  Bottom 0.178: v72.62,75 70.5,75 65,80.5 19.62,80.5 7.5,68.38 7.5,36.88 13.88,30.5 LED9.9 14,30.38 15.38,29 v25.25,29 25.62,28.62 37.12,28.62 37.38,28.88 v38.12,28.88
N$51  (via drill 0.35)
  Top 0.178: v77.75,65.38 79,65.38 TM1637-SMD3.PIN10 | v53.38,57.25 v60.12,57.25 | v51.75,55.62 46.88,55.62 38.38,47.12 v38.38,34.12 | v40.38,32.12 41.38,32.12 44.88,28.62 v44.88,22.38
  Bottom 0.178: v77.75,65.38 71.25,58.88 69.88,58.88 62.62,51.62 61.12,51.62 60.12,52.62 v60.12,57.25 | v51.75,55.62 v53.38,57.25 | v40.38,32.12 v38.38,34.12 | v44.88,22.38 46.88,20.38 LED8.5
N$52  (via drill 0.35)
  Top 0.178: v48.62,31 55.12,31 63.38,39.25 63.38,47.38 73.12,57.12 75.25,57.12 83.5,65.38 88.62,65.38 TM1637-SMD3.PIN11 | v42,27.38 38.62,27.38 36.88,29.12 36.88,30.38 LED8.10
  Bottom 0.178: v48.62,31 45,27.38 v42,27.38
N$53  (via drill 0.35)
  Top 0.178: v62,45.88 62,48.5 63.38,49.88 64.88,49.88 80,65 80,67 87.88,74.88 89.38,74.88 90,74.25 90,68 88.75,66.75 TM1637-SMD3.PIN12
  Bottom 0.178: v62,45.88 62,43.38 58.5,39.88 58.5,34.38 54.5,30.38 53.62,30.38 47.88,24.62 47.88,20 45.88,18 33.62,18 33.38,18.25 33.38,19.38 34.25,20.25 LED7.5
N$54  (via drill 0.35)
  Top 0.178: v75,58.5 76.12,58.5 85.5,67.88 88.62,67.88 TM1637-SMD3.PIN13 | v45.75,39.5 v51.38,39.5 | v19.25,31.62 v26.38,38.75 | v22.62,31.12 23.5,31.12 24.12,30.5 LED7.10
  Bottom 0.178: v75,58.5 70,58.5 61,49.5 61,44.88 55.62,39.5 v51.38,39.5 | v45.75,39.5 35.38,39.5 34.62,38.75 v26.38,38.75 | v19.25,31.62 22.12,31.62 v22.62,31.12
N$55  (via drill 0.35)
  Top 0.178: v87,68.5 87.62,69.12 88.62,69.12 TM1637-SMD3.PIN14 | v29,12.88 v33.5,12.88
  Bottom 0.178: v87,68.5 75.62,57.12 73.12,57.12 63.5,47.5 63.5,24.38 47,7.88 43.25,7.88 39.88,11.25 39.88,11.88 38.88,12.88 v33.5,12.88 | v29,12.88 21.62,20.25 LED9.5
N$56  (via drill 0.35)
  Top 0.178: v86.5,70.38 88.62,70.38 TM1637-SMD3.PIN15 | v74.62,63.25 65.38,54 57.62,54 55.75,52.12 53.75,52.12 46,44.38 46,40.75 v43.38,38.12 | v8.12,37.25 8.12,36.75 7.25,35.88 7.25,32.75 9.5,30.5 11.38,30.5 LED9.10
  Bottom 0.178: v86.5,70.38 81.75,70.38 v74.62,63.25 | v43.38,38.12 9,38.12 v8.12,37.25
N$57  (via drill 0.35)
  Top 0.178: v83.38,69.25 88.38,74.25 88.62,74.25 TM1637-SMD3.PIN18 | v63.75,49.25 63.75,48.75 62.62,47.62 62.62,45.5 55.75,38.62 46.75,38.62 44.38,36.25 41.5,36.25 37.88,32.62 37.88,32.25 | 37.88,32.25 37.88,31.88 38.38,31.38 39.62,31.38 42.75,28.25 42.75,14.5 42.62,14.38 42.62,13.25 44.38,11.5 SV3.2 | 37.88,32.25 v37.5,32.25
  Bottom 0.178: 0.1UF9.1 29.12,34.12 25.5,34.12 10K16.1 25.38,34.25 24.38,35.25 20.62,35.25 19.62,34.25 17.88,34.25 10K14.1 17.75,34.25 16.12,34.25 15.12,35.25 13,35.25 12.75,35 12.75,33.25 13.75,32.25 v37.5,32.25 | v83.38,69.25 83.38,65.38 75.5,57.5 72,57.5 v63.75,49.25
N$58  (via drill 0.35)
  Top 0.178: v61,41.38 63,43.38 63,47.5 75.5,60 77.12,60 87,69.88 89.38,69.88 89.62,70.12 89.62,72.12 88.75,73 TM1637-SMD3.PIN17 | v35,32.88 35,30.88 35.38,30.5 35.38,6.88 37,5.25 40.75,5.25 44.38,8.88 SV3.3
  Bottom 0.178: 22.69,33.06 21.62,34.12 10K15.1 | 22.69,33.06 22.75,33 30.12,33 31.25,34.12 33,34.12 0.1UF10.1 33.12,34.12 33.75,34.12 v35,32.88 | 10K13.1 14,34.12 15.75,34.12 16.88,33 22.62,33 22.69,33.06 | v61,41.38 61,23.25 46.75,9 44.5,9 SV3.3
N$59  (via drill 0.35)
  Top 0.178: v82.75,67.62 86.88,71.75 88.62,71.75 TM1637-SMD3.PIN16 | 56.06,17.94 44.5,6.38 SV3.4 | 56.06,17.94 v61.62,23.5 | v46.62,35 46.62,32 50.75,27.88 50.75,23.25 56.06,17.94
  Bottom 0.178: 10K13.2 14,37 17.75,37 10K14.2 17.88,37 21.5,37 10K15.2 21.62,37 25.38,37 10K16.2 25.5,36.88 26.5,35.88 33.38,35.88 35,34.25 36.75,34.25 0.1UF11.1 36.88,34.25 37.38,34.75 40.62,34.75 4.7UF4.1 40.75,34.62 46.25,34.62 v46.62,35 | v82.75,67.62 82.75,65.25 75.38,57.88 71.38,57.88 63.12,49.62 63.12,25 v61.62,23.5
N$60  (via drill 0.35)
  Top 0.178: v77.25,76.75 79,76.75 TM1637-SMD3.PIN1 | v74.38,69.25 73.88,69.25 64,59.38 64,58.62 60.75,55.38 56.5,55.38 45.62,44.5 45.62,41.38 v41.75,37.5 | v42.62,35.25 45.5,32.38 45.5,20.25 44.5,19.25 44.5,14 SV3.1
  Bottom 0.178: 0.1UF9.2 29.25,37 33,37 0.1UF10.2 33.12,37 36.75,37 0.1UF11.2 36.88,36.88 41,36.88 4.7UF4.2 | v77.25,76.75 77.25,72.12 v74.38,69.25 | v41.75,37.5 40.75,36.5 4.7UF4.2 | v42.62,35.25 41.12,36.75 4.7UF4.2
N$61  (via drill 0.35)
  Top 0.178: v128.75,66 128.12,66.62 126,66.62 TM1637-SMD4.PIN4 | v131.5,66 132,66 133.25,67.25 v134.5,67.25 | LED10.8 158.75,73.75 157.25,73.75 156.5,74.5 146.88,74.5 146.12,73.75 LED12.8 | v170,75.12 171.38,73.75 LED11.8
  Bottom 0.178: v131.5,66 v128.75,66 | v134.5,67.25 137.38,67.25 137.88,66.75 139.12,66.75 146,73.62 LED12.8 | v170,75.12 160.12,75.12 158.75,73.75 LED10.8
N$62  (via drill 0.35)
  Top 0.178: 159.94,73.69 160.75,74.5 168.12,74.5 168.88,73.75 LED11.9 | 159.94,73.69 159.12,72.88 157.62,72.88 156.88,73.62 156.25,73.62 LED10.9 | v123.62,68.88 124.5,68 125.88,68 TM1637-SMD4.PIN3 | v120.5,69.62 120.5,72 120.88,72.38 124.62,72.38 v127.88,75.62 | 159.94,73.69 158.75,74.88 144.75,74.88 143.62,73.75 LED12.9
  Bottom 0.178: v123.62,68.88 121.25,68.88 v120.5,69.62 | v127.88,75.62 141.62,75.62 143.5,73.75 LED12.9
N$63  (via drill 0.35)
  Top 0.178: v149.12,55.38 133,55.38 129.38,59 126,59 TM1637-SMD4.PIN10 | v150.38,54.12 167.12,54.12 176.5,63.5 LED11.5
  Bottom 0.178: v150.38,54.12 v149.12,55.38
N$64  (via drill 0.35)
  Top 0.178: v135.25,58.12 135.62,58.5 135.62,59 TM1637-SMD4.PIN11 | v136,56 146.5,56 v149.12,58.62 | v156.12,59.88 156.12,62.25 166.25,72.38 166.25,73.62 LED11.10
  Bottom 0.178: v135.25,58.12 135.25,57.75 135.12,57.62 135.12,56.88 v136,56 | v149.12,58.62 150.38,59.88 v156.12,59.88
N$65  (via drill 0.35)
  Top 0.178: v134.38,60.25 135.62,60.25 TM1637-SMD4.PIN12 | v141.5,60.5 v139,58 | v160.75,60.5 163.75,63.5 LED10.5
  Bottom 0.178: v134.38,60.25 135.62,60.25 137.88,58 v139,58 | v160.75,60.5 v141.5,60.5
N$66  (via drill 0.35)
  Top 0.178: v134.5,63.5 134.5,62.62 134.88,62.25 135,62.25 135.62,61.62 TM1637-SMD4.PIN13
  Bottom 0.178: v134.5,63.5 139.38,63.5 148.75,72.88 149.25,72.88 150.88,74.5 152.88,74.5 153.62,73.75 LED10.10
N$67  (via drill 0.35)
  Top 0.178: v137.25,59.62 137.25,61.38 136.38,62.25 136.25,62.25 135.75,62.75 TM1637-SMD4.PIN14 | v140.75,61.12 v138.25,58.62 | v150.5,61.62 150.5,62.88 LED12.5
  Bottom 0.178: v138.25,58.62 v137.25,59.62 | v140.75,61.12 150,61.12 v150.5,61.62
N$68  (via drill 0.35)
  Top 0.178: v137.62,71.12 137.62,66 136.38,64.75 136.25,64.75 135.75,64.25 TM1637-SMD4.PIN15
  Bottom 0.178: v137.62,71.12 138.38,71.12 140.88,73.62 LED12.10
N$69  (via drill 0.35)
  Top 0.178: TM1637-SMD4.PIN18 135.62,68 v133.75,68 131.88,69.88 130.25,69.88 | v124.38,69.5 125.25,68.62 128.38,68.62 129.31,69.56 | 129.31,69.56 129.62,69.88 130.25,69.88 | 130.25,69.88 v130.25,70.88 | v127.62,43.25 127.62,53.38 v129.5,55.25 | v131.62,57.75 132.75,58.88 132.75,61.62 129.38,65 129.38,69.5 129.31,69.56
  Bottom 0.178: v133.75,68 133.75,66.38 132.12,64.75 0.1UF4.1 | v124.38,69.5 123.88,69.5 122.5,70.88 120.75,70.88 10K6.1 | v130.25,70.88 128.38,70.88 10K4.1 | v127.62,43.25 127.62,27.12 143.25,11.5 143.5,11.5 SV4.2 | v129.5,55.25 131.62,57.38 v131.62,57.75
N$70  (via drill 0.35)
  Top 0.178: 133.06,66.56 131.88,65.38 v130,65.38 v130,69.25 | 133.06,66.56 133.12,66.62 135.62,66.62 TM1637-SMD4.PIN17 | v128.38,42.5 128.38,53 v130.5,55.12 | v132.38,57 132.38,58 133.12,58.75 133.12,66.5 133.06,66.56
  Bottom 0.178: 130,69.75 130.88,69.75 132,70.88 10K3.1 | 130,69.75 127.38,69.75 126.25,70.88 124.5,70.88 10K5.1 | v130,65.38 129,65.38 128.38,64.75 0.1UF5.1 | v128.38,42.5 128.38,26.88 142.38,12.88 144.25,12.88 145.38,11.75 145.38,11 143.62,9.25 143.62,9 SV4.3 | v132.38,57 v130.5,55.12 | v130,69.25 130,69.75
N$71  (via drill 0.35)
  Top 0.178: v134.38,64.5 135.25,65.38 135.62,65.38 TM1637-SMD4.PIN16 | v179.88,29.25 179.88,22.5 176.12,18.75 171.38,18.75 165.75,13.12 165.75,12.5 157.75,4.5 148.5,4.5 146.75,6.25 143.62,6.25 SV4.4
  Bottom 0.178: v134.38,64.5 134,64.5 133,63.5 126.88,63.5 125.75,64.62 124.5,64.62 0.1UF12.1 124.5,64.75 123.25,66 122.5,66 121.75,65.25 120.75,65.25 4.7UF2.1 120.62,65.25 120,65.88 119.88,65.88 119.12,66.62 119.12,72.25 120.62,73.75 10K6.2 120.75,73.88 124.38,73.88 10K5.2 124.5,73.88 128.25,73.88 10K4.2 128.38,73.88 132,73.88 10K3.2 132.12,73.75 132.88,73.75 136.12,70.5 141.5,70.5 147,76 175.38,76 179.88,71.5 v179.88,29.25
N$72  (via drill 0.35)
  Top 0.178: v142.88,33.75 142.88,34.38 v141.12,36.12 | v149.75,52.25 149.75,60.25 146.88,63.12 146.88,64.25 139,72.12 127.62,72.12 126,70.5 TM1637-SMD4.PIN1 125.88,70.38 124.12,70.38 123,69.25 v123,68.12 125.12,66 v127.12,66
  Bottom 0.178: 0.1UF4.2 132,67.5 128.38,67.5 0.1UF5.2 128.25,67.38 128.25,67.12 v127.12,66 | 0.1UF12.2 124.38,67.5 123.75,68.12 v123,68.12 121.88,67 120.75,67 4.7UF2.2 | v142.88,33.75 144.62,32 144.62,20.25 143.62,19.25 143.62,14 SV4.1 | v141.12,36.12 144.62,36.12 149.62,41.12 151.5,41.12 152.88,42.5 152.88,49.12 v149.75,52.25
N$73  (via drill 0.35)
  Top 0.178: LED14.1 166.25,42 165.5,42.75 155.12,42.75 154.38,42 153.75,42 LED13.1 153.62,41.88 152.25,41.88 151.5,41.12 141.75,41.12 141,41.88 LED15.1 140.88,42 v139.12,43.75 | v113.25,66.88 113.12,66.75 112.12,66.75 TM1637-SMD5.PIN8 | v120.12,54 121.88,52.25 124.62,52.25 v125.12,52.75
  Bottom 0.178: v113.25,66.88 113.88,66.88 116.62,64.12 116.62,58.25 120.12,54.75 v120.12,54 | v125.12,52.75 126,52.75 131.75,47 135.88,47 v139.12,43.75
N$74  (via drill 0.35)
  Top 0.178: v121.25,58 113.88,65.38 112.12,65.38 TM1637-SMD5.PIN9 | LED13.2 156.12,41.88 154.75,41.88 153.62,40.75 141,40.75 138.25,43.5 138.25,44.38 138.5,44.62 140.88,44.62 143.5,42 LED15.2
  Bottom 0.178: LED14.2 167.75,40.75 158.75,40.75 157.62,41.88 156.25,41.88 LED13.2 | v121.25,58 121.25,55.38 122.38,54.25 122.38,52.5 132.12,42.75 142.75,42.75 143.5,42 LED15.2
N$75  (via drill 0.35)
  Top 0.178: v122.75,55.12 123.5,55.88 123.5,60.75 121.25,63 120.12,63 119.5,63.62 119.5,67.62 112.88,74.25 112.12,74.25 TM1637-SMD5.PIN2 | v157,43.75 147.88,43.75 146.12,42 LED15.3
  Bottom 0.178: LED14.3 171.38,42 170.62,42.75 168.62,42.75 167,41.12 160.88,41.12 160.12,41.88 158.75,41.88 LED13.3 158.75,42 v157,43.75 | v122.75,55.12 122.75,52.62 132.25,43.12 144.88,43.12 146,42 LED15.3
N$76  (via drill 0.35)
  Top 0.178: v110.75,66.88 111.75,67.88 112,67.88 TM1637-SMD5.PIN7 | v125.75,41.62 126.25,41.62 129.62,38.25 135.12,38.25 136.25,37.12 v139.25,37.12 | v159.88,43.38 157.62,43.38 157.38,43.12 149.75,43.12 148.62,42 LED15.4
  Bottom 0.178: LED14.4 173.88,42 172.75,43.12 163.88,43.12 162.75,42 161.38,42 LED13.4 161.25,42 v159.88,43.38 | v110.75,66.88 110.75,65.38 116.25,59.88 116.25,55.62 125.75,46.12 v125.75,41.62 | v139.25,37.12 139.25,41 139.62,41.38 140.38,41.38 140.62,41.12 147.75,41.12 148.5,41.88 LED15.4
N$77  (via drill 0.35)
  Top 0.178: v121,61.25 120,61.25 118.38,62.88 118.38,64.25 112.75,69.88 112.62,69.88 112.12,70.38 TM1637-SMD5.PIN5 | LED15.6 151.25,52.12 152,52.88 162.38,52.88 163.12,52.12 163.75,52.12 LED13.6 163.88,52.12 165,53.25 174,53.25 175.12,52.12 176.5,52.12 LED14.6
  Bottom 0.178: v121,61.25 123,61.25 123.62,60.62 131.5,60.62 131.75,60.88 137.12,60.88 145.12,52.88 150.38,52.88 151.12,52.12 LED15.6
N$78  (via drill 0.35)
  Top 0.178: 167.25,52.88 173.12,52.88 173.88,52.12 LED14.7 | 167.25,52.88 166,52.88 164.38,51.25 163.5,51.25 162.75,52 161.38,52 LED13.7 | v121.75,60.5 120.25,60.5 116.75,64 116.75,64.62 112.75,68.62 112.62,68.62 112.12,69.12 TM1637-SMD5.PIN6 | v129.62,56.5 130.12,56.5 133.75,52.88 147.75,52.88 148.5,52.12 LED15.7 | 167.25,52.88 167.25,51.75 163.12,47.62 v152.25,47.62
  Bottom 0.178: v121.75,60.5 122.25,60.5 126.25,56.5 v129.62,56.5 | v152.25,47.62 152.25,48.38 148.62,52 LED15.7
N$79  (via drill 0.35)
  Top 0.178: v122.38,58.88 122.38,60.88 121,62.25 119.5,62.25 118.75,63 118.75,66.12 113.12,71.75 112.12,71.75 TM1637-SMD5.PIN4 | v131.12,50.12 137.25,50.12 138.5,48.88 v146.12,48.88 155.62,48.88 158.75,52 LED13.8
  Bottom 0.178: v131.12,50.12 v122.38,58.88 | v146.12,48.88 146.12,52 LED15.8 | LED14.8 171.38,52 170,52 169.25,51.25 159.5,51.25 158.75,52 LED13.8
N$80  (via drill 0.35)
  Top 0.178: v122.88,56.38 123,56.5 123,60.75 121.12,62.62 119.62,62.62 119.12,63.12 119.12,67.5 113.62,73 112.12,73 TM1637-SMD5.PIN3 | v138.88,49.5 141,49.5 142.81,51.31 | 142.81,51.31 143.5,52 LED15.9 | LED13.9 156.12,52 154.75,52 154,51.25 142.88,51.25 142.81,51.31
  Bottom 0.178: v122.88,56.38 123.12,56.12 123.25,56.12 125.75,53.62 125.75,53.5 129.75,49.5 v138.88,49.5 | LED14.9 168.88,52.12 167.5,52.12 166.75,52.88 157,52.88 156.25,52.12 LED13.9
N$81  (via drill 0.35)
  Top 0.178: v121.88,56.38 114.12,64.12 112.12,64.12 TM1637-SMD5.PIN10 | v135.5,46.38 151.12,46.38 151.5,46.75 171.75,46.75 176.5,42 LED14.5
  Bottom 0.178: v121.88,56.38 122.5,55.75 123.12,55.75 123.38,55.5 123.38,52.5 129.5,46.38 v135.5,46.38
N$82  (via drill 0.35)
  Top 0.178: v131.62,58.75 128.12,62.25 124.75,62.25 122.88,64.12 121.75,64.12 TM1637-SMD5.PIN11 | v142.12,48.25 162.5,48.25 166.25,52 LED14.10
  Bottom 0.178: v142.12,48.25 v131.62,58.75
N$83  (via drill 0.35)
  Top 0.178: v122.88,65.38 121.75,65.38 TM1637-SMD5.PIN12 | v122.88,62.88 122.88,62.38 125,60.25 125,58.25 v128.25,55 | v152.25,45.75 163.62,45.75 167.25,42.12 167.25,41.62 166.75,41.12 164.62,41.12 163.88,41.88 LED13.5
  Bottom 0.178: v122.88,62.88 v122.88,65.38 | v128.25,55 128.75,55 133.62,50.12 139.25,50.12 143.62,45.75 v152.25,45.75
N$84  (via drill 0.35)
  Top 0.178: v123,66.62 121.75,66.62 TM1637-SMD5.PIN13 | v138.25,67.38 138.25,62.38 v139.12,61.5
  Bottom 0.178: v123,66.62 123.25,66.38 125.5,66.38 127.12,68 127.12,68.38 127.38,68.62 137,68.62 v138.25,67.38 | v139.12,61.5 147.38,53.25 152.5,53.25 153.62,52.12 LED13.10
N$85  (via drill 0.35)
  Top 0.178: v140,40.75 128.62,40.75 125.75,43.62 125.75,53.12 124.62,54.25 124.62,60.12 121.38,63.38 121.12,63.38 120.75,63.75 120.75,67.12 120.88,67.25 121,67.25 121.62,67.88 TM1637-SMD5.PIN14
  Bottom 0.178: v140,40.75 148.75,40.75 149.88,41.88 151.12,41.88 LED15.5
N$86  (via drill 0.35)
  Top 0.178: v120.5,68.62 121,69.12 121.62,69.12 TM1637-SMD5.PIN15 | v136.88,69.25 136.88,66.5 136.38,66 134.88,66 133.75,64.88 133.75,58.62 135.12,57.25 v135.75,57.25
  Bottom 0.178: v120.5,68.62 119.5,69.62 119.5,71.88 119.75,72.12 134,72.12 v136.88,69.25 | v135.75,57.25 140.88,52.12 LED15.10
N$87  (via drill 0.35)
  Top 0.178: v157.5,57 152.88,61.62 152.88,63.38 151.5,64.75 148.75,64.75 139.75,73.75 131,73.75 128.5,76.25 127.5,76.25 124.38,73.12 121.75,73.12 TM1637-SMD5.PIN18 | v141.12,37.12 144.88,33.38 145.25,33.38 145.5,33.12 145.5,31.38 143.38,29.25 143.38,27.62 144.38,26.62 144.38,17.25 149.75,11.88 149.75,11.5 SV5.2 | v156.12,53.5 v154.12,53.5
  Bottom 0.178: 0.1UF13.1 v157.5,57 | 0.1UF13.1 162.5,55.75 10K20.1 162.62,55.75 163.75,56.88 167.38,56.88 168.5,55.75 170.12,55.75 10K18.1 | v141.12,37.12 140.5,36.5 140.5,35.75 140.75,35.5 144.5,35.5 149.38,40.38 152,40.38 152.75,41.12 154,41.12 154.5,41.62 154.5,53.12 v154.12,53.5 | v156.12,53.5 158.5,55.88 0.1UF13.1
N$88  (via drill 0.35)
  Top 0.178: v153.88,57.12 152.25,58.75 152.25,63.5 151.38,64.38 148.25,64.38 139.25,73.38 126.12,73.38 124.62,71.88 121.75,71.88 TM1637-SMD5.PIN17 | v159.62,38.75 159.62,35.12 157.62,33.12 155.12,33.12 152.88,30.88 152.88,12.25 149.88,9.25 149.88,9 SV5.3
  Bottom 0.178: v153.88,57.12 153.88,56.75 154.88,55.75 0.1UF14.1 155,55.75 155,54.12 155.38,53.75 155.38,51.75 156.88,50.25 174.88,50.25 | 172.94,54.69 173.88,55.62 10K17.1 | 172.94,54.69 172.88,54.62 169.12,54.62 168.12,55.62 166.38,55.62 10K19.1 | v159.62,38.75 172,38.75 174.88,41.62 174.88,50.25 | 174.88,50.25 174.88,52.75 172.94,54.69
N$89  (via drill 0.35)
  Top 0.178: TM1637-SMD5.PIN16 121.75,70.5 123.75,70.5 126.25,73 138.62,73 147.75,63.88 147.75,62.75 150.38,60.12 v150.38,57.12 152.88,57.12 154.25,55.75 159.75,55.75 v161.25,57.25 | v153.88,10.38 153.88,11.38 155.38,12.88 164.12,12.88 170.38,19.12 174,19.12 176,21.12 v176,25.38
  Bottom 0.178: v150.38,57.12 150.38,56.5 0.1UF15.1 150.38,56.38 147.38,56.38 4.7UF5.1 | v153.88,10.38 149.88,6.38 SV5.4 | v176,25.38 176,27.75 179.5,31.25 179.5,53 174,58.5 10K17.2 173.88,58.62 170.25,58.62 10K18.2 170.12,58.62 166.38,58.62 10K19.2 166.25,58.62 162.62,58.62 10K20.2 162.5,58.5 v161.25,57.25
N$90  (via drill 0.35)
  Top 0.178: v120.12,64 120.12,67.5 112.12,75.5 TM1637-SMD5.PIN1 | v146,58 v141,58 | v157.75,39.25 157.75,33.75 157.5,33.5 155,33.5 152.5,31 152.5,20.5 149.88,17.88 149.88,14 SV5.1
  Bottom 0.178: v120.12,64 120.75,64 123.75,61 131.38,61 131.62,61.25 137.75,61.25 v141,58 | v146,58 4.7UF5.2 150.62,58 151.12,58.5 0.1UF15.2 151.25,58.62 153.25,58.62 | 153.25,58.62 154.88,58.62 0.1UF14.2 155,58.62 158.75,58.62 0.1UF13.2 | v157.75,39.25 154.88,42.12 154.88,53.75 153.25,55.38 153.25,58.62
N$91  (via drill 0.35)
  Top 0.178: 153.62,19.12 153.62,20.25 LED16.1 | 153.62,19.12 153.62,12.5 151.88,10.75 151.88,8.62 151.12,7.88 148.62,7.88 147.38,9.12 147.38,12.38 141,18.75 141,20.25 LED18.1 | v109,78.25 108,77.25 108,75.38 100.62,68 99.38,68 TM1637-SMD6.PIN8 | v174.38,77 178.5,72.88 v178.5,32.62 | 153.62,19.12 165.12,19.12 166.25,20.25 LED17.1
  Bottom 0.178: v109,78.25 173.12,78.25 v174.38,77 | v178.5,32.62 178.5,31.25 168.75,21.5 167.5,21.5 166.38,20.38 LED17.1
N$92  (via drill 0.35)
  Top 0.178: v148,12.25 143.62,16.62 143.62,20.25 LED18.2 | TM1637-SMD6.PIN9 99.38,66.75 100.12,66.75 108.38,75 110.12,75 112.75,77.62 175.75,77.62 182.5,70.88 182.5,33.88 169,20.38 LED17.2
  Bottom 0.178: v148,12.25 148,6 148.75,5.25 152.88,5.25 155.5,7.88 157.5,7.88 158,8.38 158,18.5 157.94,18.56 | 157.94,18.56 156.25,20.25 LED16.2 | 157.94,18.56 158,18.62 167.25,18.62 168.88,20.25 LED17.2
N$93  (via drill 0.35)
  Top 0.178: v144.25,80.5 143.62,79.88 109.12,79.88 104.88,75.62 99.38,75.62 TM1637-SMD6.PIN2 | v182.5,32.88 171.5,21.88 171.5,20.38 LED17.3
  Bottom 0.178: v144.25,80.5 172.88,80.5 182.5,70.88 v182.5,32.88 182.5,11.5 174.25,3.25 149.25,3.25 146.12,6.38 146.12,20.25 LED18.3 | LED16.3 158.75,20.25 160.25,20.25 161,19.5 167,19.5 168.62,21.12 170.62,21.12 171.38,20.38 LED17.3
N$94  (via drill 0.35)
  Top 0.178: v100.62,69.75 100.12,69.25 99.38,69.25 TM1637-SMD6.PIN7 | LED16.4 161.38,20.38 162.75,20.38 163.5,21.12 167,21.12 168.62,19.5 173.12,19.5 173.88,20.25 LED17.4
  Bottom 0.178: v100.62,69.75 100.62,73.5 104.75,77.62 172.75,77.62 174,76.38 175.5,76.38 181.5,70.38 181.5,35.38 181.25,35.12 181.25,27.62 174,20.38 LED17.4 174,20.25 177.62,16.62 177.62,7.62 174,4 149.5,4 147.38,6.12 147.38,13.75 148.5,14.88 148.5,20.25 LED18.4
N$95  (via drill 0.35)
  Top 0.178: v103.38,71.75 99.38,71.75 TM1637-SMD6.PIN5 | v115.62,59.5 117.38,59.5 118.62,58.25 118.62,56.5 v121.38,53.75 | v136.62,37.75 141.5,37.75 144.56,34.69 | 144.56,34.69 144.75,34.5 144.75,34 145,33.75 146.62,33.75 149.88,30.5 151.12,30.5 LED18.6 | v156.62,38.12 148,38.12 144.56,34.69
  Bottom 0.178: 175.31,31.69 176.5,30.5 LED17.6 | 175.31,31.69 175.25,31.75 166.5,31.75 165.25,30.5 163.88,30.5 LED16.6 | v115.62,59.5 v103.38,71.75 | v121.38,53.75 121.38,52.5 136.12,37.75 v136.62,37.75 | v156.62,38.12 171.88,38.12 172.5,38.75 175.75,38.75 176,38.5 176,37.75 175.38,37.12 175.38,31.75 175.31,31.69
N$96  (via drill 0.35)
  Top 0.178: v102,70.38 99.38,70.38 TM1637-SMD6.PIN6 | v115.62,57.75 115.62,57.25 118.5,54.38 v119,54.38 | v154.62,40.25 159.62,40.25 167.25,32.62 167.25,30.25 166.62,29.62 163.5,29.62 162.75,30.38 161.38,30.38 LED16.7 | v149.62,37.5 149.62,35.75 v148.88,35
  Bottom 0.178: LED16.7 161.38,30.38 162.75,30.38 163.5,29.62 169.5,29.62 171.25,31.38 173,31.38 173.88,30.5 LED17.7 | v102,70.38 103,70.38 v115.62,57.75 | v119,54.38 119,53.88 138.12,34.75 144.75,34.75 145,35 145.75,35 146.25,34.5 146.25,34 146.62,33.62 148.75,33.62 148.81,33.56 | 148.81,33.56 149,33.38 149,30.88 148.62,30.5 LED18.7 | v154.62,40.25 152.38,40.25 v149.62,37.5 | v148.88,35 148.88,33.62 148.81,33.56
N$97  (via drill 0.35)
  Top 0.178: v107.38,75.75 104.75,73.12 99.38,73.12 TM1637-SMD6.PIN4 | v171.75,77 178.12,70.62 178.12,37.12 173.06,32.06 | 173.06,32.06 171.5,30.5 LED17.8 | v181.88,34.75 181.62,34.75 178.88,32 173.12,32 173.06,32.06
  Bottom 0.178: v107.38,75.75 124.75,75.75 126,77 v171.75,77 | v181.88,34.75 181.88,11.38 174.12,3.62 149.38,3.62 146.75,6.25 146.75,10 146.88,10.12 146.88,20.62 146.12,21.38 146.12,30.38 LED18.8 | LED16.8 158.75,30.38 160.25,30.38 161.38,29.25 170.25,29.25 171.38,30.38 LED17.8
N$98  (via drill 0.35)
  Top 0.178: LED16.9 156.25,30.38 157.75,30.38 158.88,29.25 167.75,29.25 168.88,30.38 LED17.9 168.88,30.5 168.88,31.62 159.62,40.88 154.25,40.88 152.62,39.25 v132.12,39.25 | v104.88,74.25 99.38,74.25 TM1637-SMD6.PIN3 | v113.75,66 114.25,66 v122.38,57.88 | v126.38,45 v126.38,53.88
  Bottom 0.178: v104.88,74.25 113.12,66 v113.75,66 | v126.38,53.88 v122.38,57.88 | v126.38,45 126.88,45 132.38,39.5 | 132.38,39.5 140.12,31.75 142.25,31.75 143.5,30.5 LED18.9 | 132.38,39.5 v132.12,39.25
N$99  (via drill 0.35)
  Top 0.178: v143.25,80.5 101.62,80.5 98,76.88 98,66.12 98.62,65.5 99.25,65.5 TM1637-SMD6.PIN10 | v175.38,77 175.38,76.5 180.88,71 v180.88,35.75 | v176.62,24 176.62,20.38 LED17.5
  Bottom 0.178: v143.25,80.5 144.12,79.62 172.75,79.62 v175.38,77 | v180.88,35.75 180.88,28.25 v176.62,24
N$100
  Top 0.178: TM1637-SMD6.PIN11 109,65.38 109,63.38 125.38,47 125.38,43 129.75,38.62 156.12,38.62 157.38,39.88 159.5,39.88 160.25,39.12 160.25,36.5 166.25,30.5 LED17.10
N$101  (via drill 0.35)
  Top 0.178: v124,52.88 119,57.88 119,58.38 116.12,61.25 113.5,61.25 111.12,63.62 111.12,64.62 109.75,66 109.62,66 109,66.62 TM1637-SMD6.PIN12 | v129.88,47 133.88,47 135.12,45.75 151,45.75 151.62,46.38 165.62,46.38 169.75,42.25 v169.75,26.62
  Bottom 0.178: v129.88,47 v124,52.88 | v169.75,26.62 169.75,26.25 163.88,20.38 LED16.5
N$102  (via drill 0.35)
  Top 0.178: v106.62,76.38 105.25,75 98.62,75 98.38,74.75 98.38,66.25 98.62,66 100,66 101.88,67.88 108.88,67.88 TM1637-SMD6.PIN13 | v119.75,76.38 120.38,77 169.25,77 177.75,68.5 177.75,37.88 170.38,30.5 170.38,26.25 170.12,26 158.5,26 154.12,30.38 153.75,30.38 LED16.10
  Bottom 0.178: v119.75,76.38 v106.62,76.38
N$103  (via drill 0.35)
  Top 0.178: v116.88,67 112.75,71.12 108.25,71.12 108,70.88 108,70.12 108.88,69.25 TM1637-SMD6.PIN14 | v127,55.25 127,42.88 128.5,41.38 v129,41.38 | v144,28.62 144,27.5 151.12,20.38 LED18.5
  Bottom 0.178: v116.88,67 116.88,65.88 119.62,63.12 119.62,60.62 120.75,59.5 122.75,59.5 v127,55.25 | v129,41.38 132.12,38.25 133.12,38.25 140,31.38 141.25,31.38 v144,28.62
N$104
  Top 0.178: TM1637-SMD6.PIN15 109,70.38 109.5,69.88 109.62,69.88 109.88,69.62 109.88,67.5 109.62,67.25 108.25,67.25 108,67 108,63.88 124.38,47.5 124.38,39.5 133.38,30.5 140.88,30.5 LED18.10
N$105  (via drill 0.35)
  Top 0.178: v110.62,72.88 109.25,74.25 109,74.25 TM1637-SMD6.PIN18 | v139.62,35.75 139.62,33 139.94,32.69 | 139.94,32.69 141.75,30.88 141.75,22.25 140.12,20.62 140.12,12.62 142.75,10 146,10 148.62,7.38 153,7.38 155.12,5.25 157.38,5.25 158,5.88 158,9.62 156.25,11.38 SV6.2 | v157.12,34.12 149.5,34.12 v148.38,33 | v144.88,32.75 140,32.75 139.94,32.69
  Bottom 0.178: 158.75,34.12 162.5,34.12 10K24.1 162.62,34.12 163.75,33 167.38,33 168.5,34.12 170.12,34.12 10K22.1 | v110.62,72.88 110.62,71.62 118.38,63.88 118.38,57.75 122,54.12 122,52.38 132.5,41.88 133.5,41.88 v139.62,35.75 | v157.12,34.12 158.75,34.12 | v148.38,33 145.12,33 v144.88,32.75 | 158.75,34.12 0.1UF16.1
N$106  (via drill 0.35)
  Top 0.178: v107.62,73 108.88,73 TM1637-SMD6.PIN17 | v117.25,56.62 v117.25,58.62 | v145.38,34.38 149.25,34.38 149.62,34.75 v156.38,34.75 | v154.62,28.88 v154.62,19.75
  Bottom 0.178: 10K21.1 173.88,34.25 172.88,35.25 169.12,35.25 168.12,34.25 166.38,34.25 10K23.1 166.25,34.25 164.5,34.25 163.5,35.25 156.88,35.25 v156.38,34.75 155.5,34.75 155,34.25 0.1UF17.1 154.88,34.12 154.62,33.88 v154.62,28.88 | v107.62,73 108.12,73 113.88,67.25 114,67.25 117.25,64 v117.25,58.62 | v117.25,56.62 117.25,55.12 138,34.38 v145.38,34.38 | v154.62,19.75 154.38,19.5 154.38,11 156.12,9.25 156.12,9 SV6.3
N$107  (via drill 0.35)
  Top 0.178: v152.5,10 156.12,6.38 SV6.4 | v113.25,72.38 111.25,72.38 110.75,71.88 109,71.88 TM1637-SMD6.PIN16 | v130.75,75 144.38,75 144.88,75.5 168.25,75.5 177.38,66.38 177.38,40.12 v175.38,38.12 | v157.12,35.88 v153.38,35.88
  Bottom 0.178: 4.7UF6.1 147.38,34.75 147.62,34.75 148.5,35.62 149.75,35.62 151.12,34.25 0.1UF18.1 | v152.5,10 152.5,32.88 151.25,34.12 0.1UF18.1 | v113.25,72.38 117.12,72.38 119.75,75 v130.75,75 | v175.38,38.12 175.12,38.12 174,37 10K21.2 173.88,37 170.25,37 10K22.2 170.12,37 166.38,37 10K23.2 166.25,37 162.62,37 10K24.2 162.5,36.88 161.5,35.88 v157.12,35.88 | v153.38,35.88 151.5,34 0.1UF18.1
N$108  (via drill 0.35)
  Top 0.178: v104.88,76.75 99.38,76.75 TM1637-SMD6.PIN1
  Bottom 0.178: 0.1UF17.2 154.88,37 151.25,37 0.1UF18.2 151.12,36.88 147.75,36.88 147.38,36.5 4.7UF6.2 147.25,36.38 145.88,36.38 144.62,35.12 138.25,35.12 120.75,52.62 120.75,54.62 117.88,57.5 117.88,63.88 114.12,67.62 114,67.62 v104.88,76.75 | 155.5,37 155,37 0.1UF17.2 | 155.5,37 158.75,37 0.1UF16.2 | 155.5,37 152.88,34.38 152.88,22.5 156.12,19.25 156.12,14 SV6.1 | 155.5,37 0.1UF17.2
(copper drawn outside any net)
  shapes: Top area x2